# Altium project CSD_25.PrjPcb
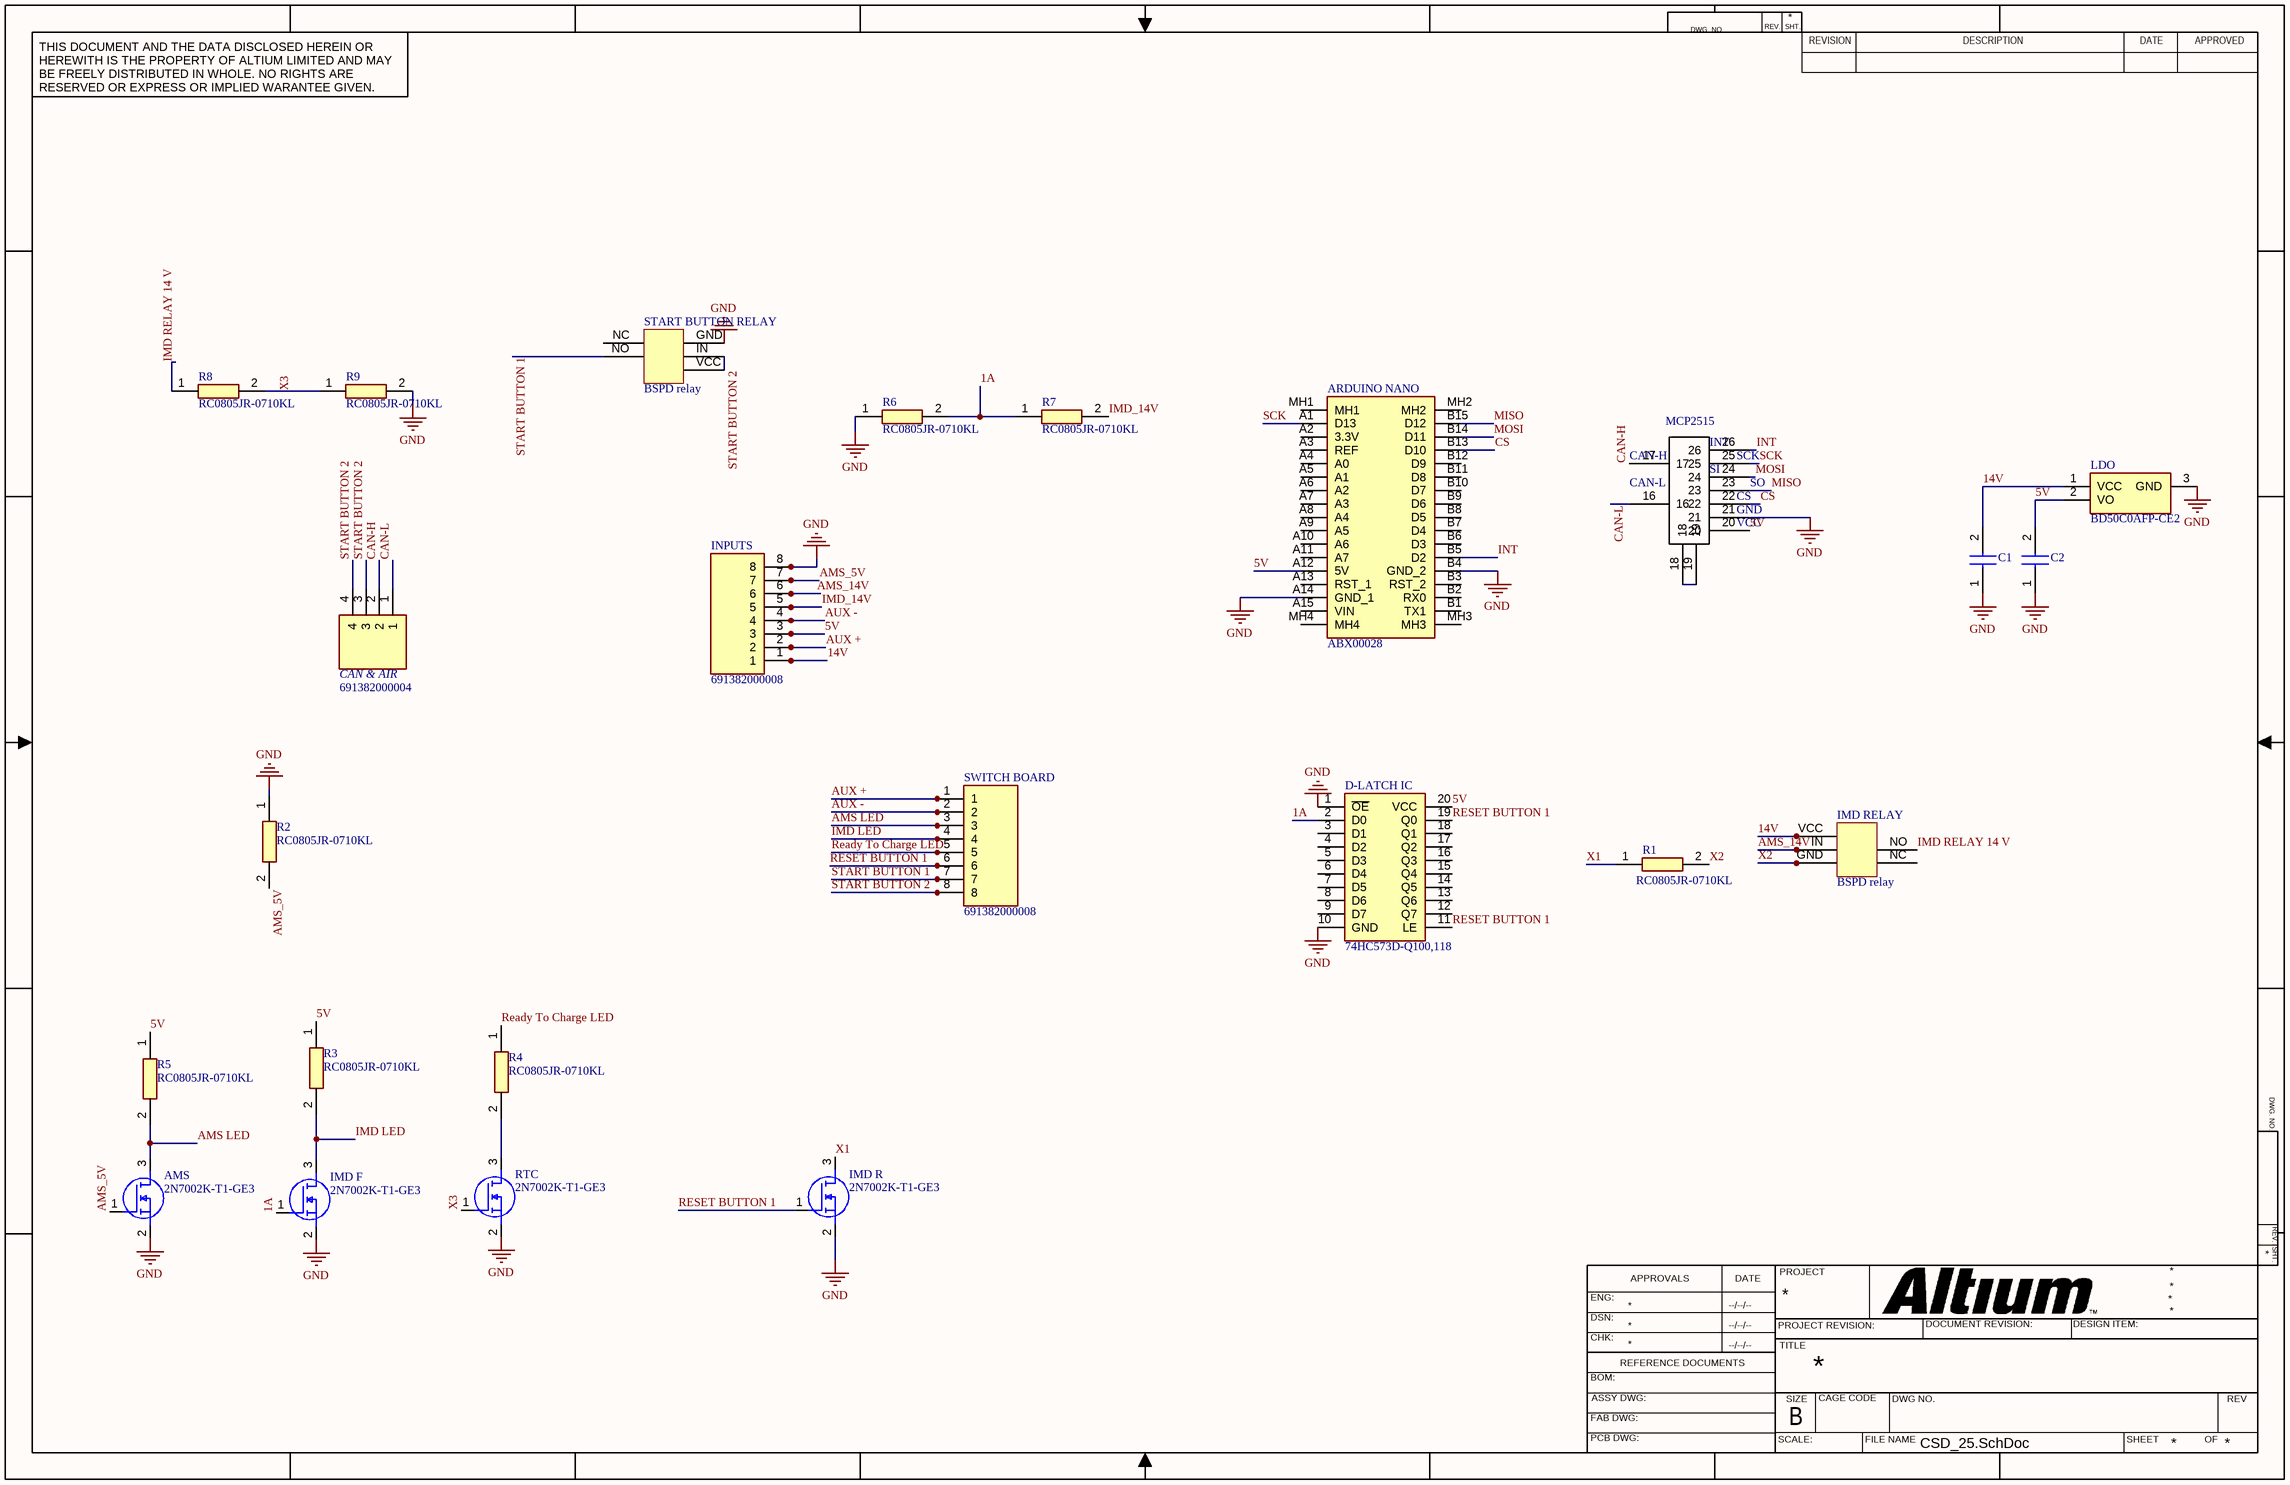
[diagram p0: CSD_25.SchDoc]
1 sheet, 24 parts. Net scope: global (net labels, ports and power ports of the same name join across sheets).
Board file: CSD_25.PcbDoc

## Sheet CSD_25.SchDoc
size 431 x 279 mm; ENG_APP_DATE: --/--/--; DSN_APP_DATE: --/--/--; CHK_APP_DATE: --/--/--

### Parts
AMS  2N7002K-T1-GE3  [SOT95P237X112-3N]
ARDUINO_NANO  ABX00028  [ABX00028]
C1  C0805C100K5GACTU  [C0805]  (value not drawn)
C2  C0805C100K5GACTU  [C0805]  (value not drawn)
CAN_&_AIR  691382000004  [SHDR4W80P0X250_1X4_1200X810X1010P]
D-LATCH_IC  74HC573D-Q100,118  [SOIC127P1032X265-20N]
IMD_F  2N7002K-T1-GE3  [SOT95P237X112-3N]
IMD_R  2N7002K-T1-GE3  [SOT95P237X112-3N]
IMD_RELAY  BSPD relay  [relay]
INPUTS  691382000008  [SHDR8W80P0X250_1X8_2200X810X1010P]
LDO  BD50C0AFP-CE2  [TO-252-3_1]
MCP2515  MCP2515  [MCP2515_footprint]  (value not drawn)
R1  RC0805JR-0710KL  [RESC2012X60N]
R2  RC0805JR-0710KL  [RESC2012X60N]
R3  RC0805JR-0710KL  [RESC2012X60N]
R4  RC0805JR-0710KL  [RESC2012X60N]
R5  RC0805JR-0710KL  [RESC2012X60N]
R6  RC0805JR-0710KL  [RESC2012X60N]
R7  RC0805JR-0710KL  [RESC2012X60N]
R8  RC0805JR-0710KL  [RESC2012X60N]
R9  RC0805JR-0710KL  [RESC2012X60N]
RTC  2N7002K-T1-GE3  [SOT95P237X112-3N]
START_BUTTON_RELAY  BSPD relay  [relay]
SWITCH_BOARD  691382000008  [SHDR8W80P0X250_1X8_2200X810X1010P]

### Nets
GND: AMS.2(S) ARDUINO_NANO.A14(GND_1) ARDUINO_NANO.B4(GND_2) C1.1 C2.1 D-LATCH_IC.1(~{OE}) D-LATCH_IC.10(GND) IMD_F.2(S) IMD_R.2(S) INPUTS.8 LDO.3(GND) MCP2515.21 R2.1 R6.1 R9.2 RTC.2(S) START_BUTTON_RELAY.GND
1A: D-LATCH_IC.2(D0) IMD_F.1(G) R6.2 R7.1
5V: ARDUINO_NANO.A12(5V) C2.2 D-LATCH_IC.20(VCC) INPUTS.3 LDO.2(VO) MCP2515.20 R3.1 R5.1
14V: C1.2 IMD_RELAY.VCC INPUTS.1 LDO.1(VCC)
AMS LED: AMS.3(D) R5.2 SWITCH_BOARD.3
AMS_5V: AMS.1(G) INPUTS.7 R2.2
AMS_14V: IMD_RELAY.IN INPUTS.6
AUX +: INPUTS.2 SWITCH_BOARD.1
AUX -: INPUTS.4 SWITCH_BOARD.2
CAN-H: CAN_&_AIR.2 MCP2515.17
CAN-L: CAN_&_AIR.1 MCP2515.16
CS: ARDUINO_NANO.B13(D10) MCP2515.22
IMD LED: IMD_F.3(D) R3.2 SWITCH_BOARD.4
IMD RELAY 14 V: IMD_RELAY.NO R8.1
IMD_14V: INPUTS.5 R7.2
INT: ARDUINO_NANO.B5(D2) MCP2515.26
MISO: ARDUINO_NANO.B15(D12) MCP2515.23
MOSI: ARDUINO_NANO.B14(D11) MCP2515.24
Ready To Charge LED: R4.1 SWITCH_BOARD.5
RESET BUTTON 1: D-LATCH_IC.11(LE) D-LATCH_IC.19(Q0) IMD_R.1(G) SWITCH_BOARD.6
SCK: ARDUINO_NANO.A1(D13) MCP2515.25
START BUTTON 1: START_BUTTON_RELAY.NO SWITCH_BOARD.7
START BUTTON 2: CAN_&_AIR.3 CAN_&_AIR.4 START_BUTTON_RELAY.IN START_BUTTON_RELAY.VCC SWITCH_BOARD.8
X1: IMD_R.3(D) R1.1
X2: IMD_RELAY.GND R1.2
X3: R8.2 R9.1 RTC.1(G)
NetMCP2515_18: MCP2515.18 MCP2515.19
NetR4_2: R4.2 RTC.3(D)

Not connected (* = marked no-connect by the designer): ARDUINO_NANO A2(3.3V) A3(REF) A4(A0) A5(A1) A6(A2) A7(A3) A8(A4) A9(A5) A10(A6) A11(A7) A13(RST_1) A15(VIN) B1(TX1) B2(RX0) B3(RST_2) B6(D3) B7(D4) B8(D5) B9(D6) B10(D7) B11(D8) B12(D9) MH1 MH2 MH3 MH4; D-LATCH_IC 3(D1) 4(D2) 5(D3) 6(D4) 7(D5) 8(D6) 9(D7) 12(Q7) 13(Q6) 14(Q5) 15(Q4) 16(Q3) 17(Q2) 18(Q1); IMD_RELAY NC; START_BUTTON_RELAY NC

### Notes on the sheet
- DWG. NO.
- REV.
- SHT.
- THIS DOCUMENT AND THE DATA DISCLOSED HEREIN OR HEREWITH IS THE PROPERTY OF ALTIUM LIMITED AND MAY BE FREELY DISTRIBUTED IN WHOLE. NO RIGHTS ARE RESERVED OR EXPRESS OR IMPLIED WARANTEE GIVEN.
- REVISION
- DESCRIPTION
- DATE
- APPROVED
- ENG:
- APPROVALS
- PROJECT
- DSN:
- CHK:
- REFERENCE DOCUMENTS
- PROJECT REVISION:
- TITLE
- DOCUMENT REVISION:
- DESIGN ITEM:
- BOM:
- FAB DWG:
- PCB DWG:
- ASSY DWG:
- SCALE:
- SIZE
- B
- CAGE CODE
- FILE NAME
- DWG NO.
- SHEET
- OF
- REV
- (in symbol MCP2515) INT; CAN-H; SCK; SI; CAN-L; SO; CS; GND; VCC

### Library data of the parts
AMS IMD_F IMD_R RTC = 2N7002K-T1-GE3: MOSFET (N-Channel); Manufacturer_Name: Vishay; Datasheet Link: https://www.vishay.com/docs/71333/2n7002k.pdf; Height: 1.12mm; Manufacturer_Part_Number: 2N7002K-T1-GE3; Mouser Part Number: 781-2N7002K-GE3; Mouser Price/Stock: https://www.mouser.co.uk/ProductDetail/Vishay-Semiconductors/2N7002K-T1-GE3?qs=45wPT2wjtGnHy1uvyAq5Mg%3D%3D; Arrow Part Number: 2N7002K-T1-GE3; Arrow Price/Stock: https://www.arrow.com/en/products/2n7002k-t1-ge3/vishay?region=nac
ARDUINO_NANO = ABX00028: Integrated Circuit; Manufacturer_Name: Arduino; Datasheet Link: https://store.arduino.cc/arduino-nano-every; Height: 10mm; Manufacturer_Part_Number: ABX00028; Mouser Part Number: 782-ABX00028; Mouser Price/Stock: https://www.mouser.co.uk/ProductDetail/Arduino/ABX00028?qs=PzGy0jfpSMtit6rnFl8mVg%3D%3D; Arrow Part Number: ABX00028; Arrow Price/Stock: https://www.arrow.com/en/products/abx00028/arduino-corporation?region=nac
C1 C2 = C0805C100K5GACTU: Capacitor; Manufacturer_Name: KEMET; Datasheet Link: https://content.kemet.com/datasheets/KEM_C1003_C0G_SMD.pdf; Height: 1.1mm; Manufacturer_Part_Number: C0805C100K5GACTU; Mouser Part Number: 80-C0805C100K5G; Mouser Price/Stock: https://www.mouser.co.uk/ProductDetail/KEMET/C0805C100K5GACTU?qs=3SD0MEbi8oiSMc603vV8xA%3D%3D; Arrow Part Number: C0805C100K5GACTU; Arrow Price/Stock: https://www.arrow.com/en/products/c0805c100k5gactu/kemet-corporation
CAN_&_AIR = 691382000004: Connector; Manufacturer_Name: Wurth Elektronik; Datasheet Link: http://katalog.we-online.de/em/datasheet/6913820000xx.pdf; Height: 10.1mm; Manufacturer_Part_Number: 691382000004; Mouser Part Number: 710-691382000004; Mouser Price/Stock: https://www.mouser.co.uk/ProductDetail/Wurth-Elektronik/691382000004?qs=a9WhcLg8qCyFbLIGoZKy%252Bg%3D%3D
D-LATCH_IC = 74HC573D-Q100,118: Integrated Circuit; Manufacturer_Name: Nexperia; Datasheet Link: https://assets.nexperia.com/documents/data-sheet/74HC_HCT573_Q100.pdf; Height: 2.65mm; Manufacturer_Part_Number: 74HC573D-Q100,118; Mouser Part Number: 771-74HC573D-Q100118; Mouser Price/Stock: https://www.mouser.co.uk/ProductDetail/Nexperia/74HC573D-Q100118?qs=1sbE9T7hb3btCWmlkzpPjQ%3D%3D; Arrow Part Number: 74HC573D-Q100,118; Arrow Price/Stock: https://www.arrow.com/en/products/74hc573d-q100118/nexperia?region=nac
IMD_RELAY START_BUTTON_RELAY = leone_relay
INPUTS SWITCH_BOARD = 691382000008: Connector; Manufacturer_Name: Wurth Elektronik; Datasheet Link: http://katalog.we-online.de/em/datasheet/6913820000xx.pdf; Height: 10.1mm; Manufacturer_Part_Number: 691382000008; Mouser Part Number: 710-691382000008; Mouser Price/Stock: https://www.mouser.co.uk/ProductDetail/Wurth-Elektronik/691382000008?qs=a9WhcLg8qCyuKMyFRlGfoA%3D%3D
LDO = BD50C0AFP-CE2: Integrated Circuit; Manufacturer_Name: ROHM Semiconductor; Datasheet Link: https://datasheet.datasheetarchive.com/originals/distributors/DKDS-10/186392.pdf; Manufacturer_Part_Number: BD50C0AFP-CE2; Mouser Part Number: 755-BD50C0AFP-CE2; Mouser Price/Stock: https://www.mouser.co.uk/ProductDetail/ROHM-Semiconductor/BD50C0AFP-CE2?qs=WHeKGGBt0W9eizcry0Olog%3D%3D
MCP2515 = MCP2515: pin to pad: 16>11 17>10 18>8 19>9 20>7 21>6 22>5 23>4 24>3 25>2 26>1
R1-R9 = RC0805JR-0710KL: Resistor; Manufacturer_Name: KEMET; Datasheet Link: http://www.yageo.com/documents/recent/PYu-RC_Group_51_RoHS_L_10.pdf; Height: 0.6mm; Manufacturer_Part_Number: RC0805JR-0710KL; Mouser Part Number: 603-RC0805JR-0710KL; Mouser Price/Stock: https://www.mouser.co.uk/ProductDetail/YAGEO/RC0805JR-0710KL?qs=ZFGQJeMQzF5q%2Fp77vM%2FrVQ%3D%3D; Arrow Part Number: RC0805JR-0710KL; Arrow Price/Stock: https://www.arrow.com/en/products/rc0805jr-0710kl/yageo